# EAGLE design PCB (EAGLE 7.6.0)
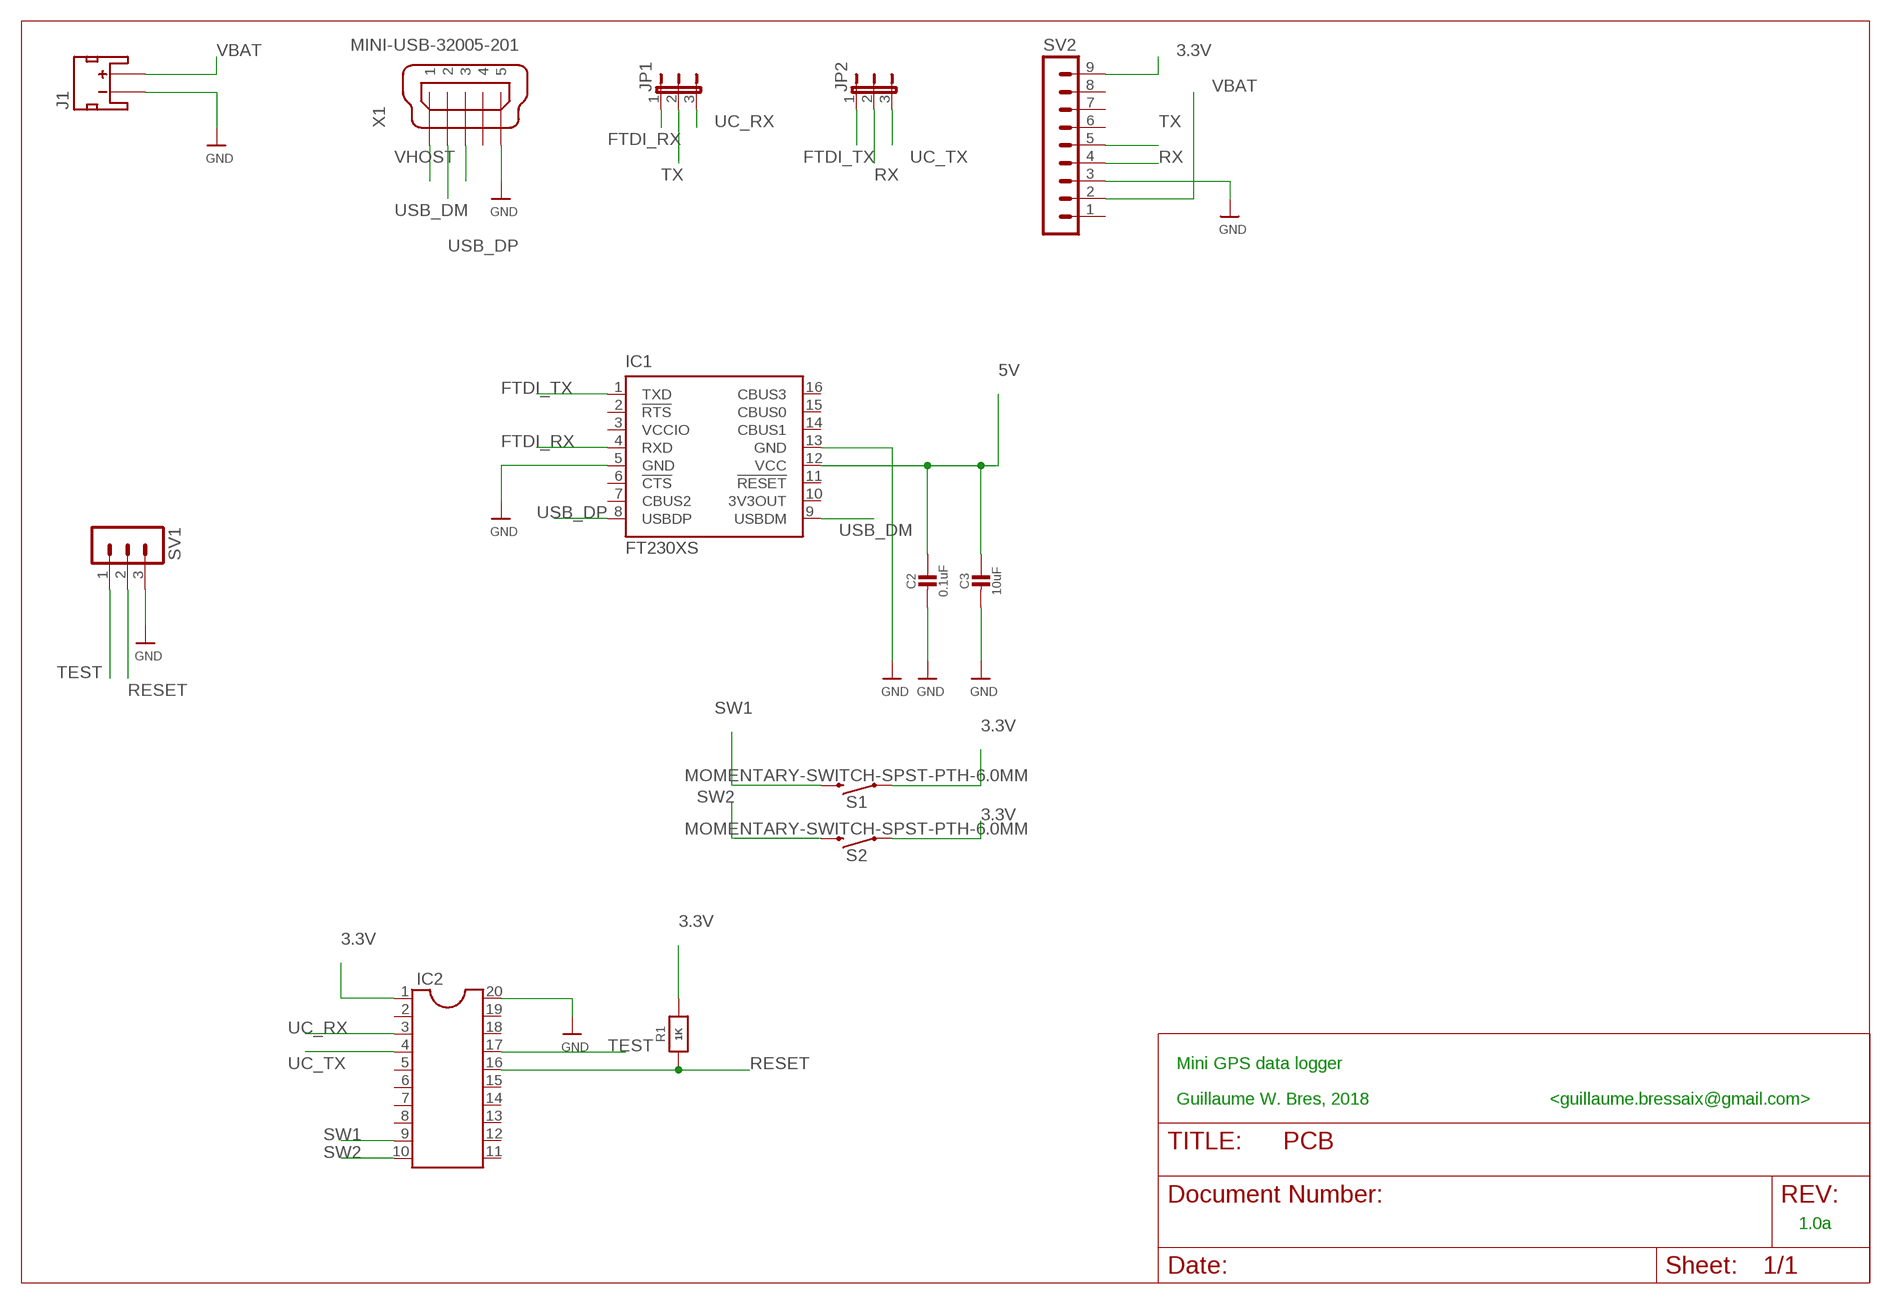
[diagram p0: schematic, sheet 1]

## Parts
C2  0.1uF  CAP_CERAMIC0805-NOOUTLINE  [0805-NO]
C3  10uF  CAP_CERAMIC0805-NOOUTLINE  [0805-NO]
IC1  FT230XS  [SSOP16]
IC2  DIL20  [DIL20]
J1  JST_2MM_MALE  [JST-2-SMD]
JP1  JP2E  [JP2]
JP2  JP2E  [JP2]
R1  1K  RESISTOR0805_NOOUTLINE  [0805-NO]
S1  MOMENTARY-SWITCH-SPST-PTH-6.0MM  [TACTILE_SWITCH_PTH_6.0MM]
S2  MOMENTARY-SWITCH-SPST-PTH-6.0MM  [TACTILE_SWITCH_PTH_6.0MM]
SV1  MA03-1  [MA03-1]
SV2  MA09-1  [MA09-1]
X1  MINI-USB-32005-201  [32005-201]

## Nets
3.3V: IC2.1 R1.2 S1.1 S2.1 SV2.9
5V: C2.1 C3.1 IC1.12(VCC)
FTDI_RX: IC1.4(RXD) JP1.1
FTDI_TX: IC1.1(TXD) JP2.1
GND: C2.2 C3.2 IC1.5(GND) IC1.13(GND) IC2.20 J1.1(-) SV1.3 SV2.3 X1.5
RESET: IC2.16 R1.1 SV1.2
RX: JP2.2 SV2.4
SW1: IC2.9 S1.3
SW2: IC2.10 S2.3
TEST: IC2.17 SV1.1
TX: JP1.2 SV2.5
UC_RX: IC2.3 JP1.3
UC_TX: IC2.4 JP2.3
USB_DM: IC1.9(USBDM) X1.2
USB_DP: IC1.8(USBDP) X1.3
VBAT: J1.2(+) SV2.2
VHOST: X1.1
Unconnected: IC1.2(!RTS) IC1.6(!CTS) IC1.7(CBUS2) IC1.10(3V3OUT) IC1.11(!RESET) IC1.14(CBUS1) IC1.15(CBUS0) IC1.16(CBUS3) IC2.2 IC2.5 IC2.6 IC2.7 IC2.8 IC2.11 IC2.12 IC2.13 IC2.14 IC2.15 IC2.18 IC2.19 J1.NC1(PAD1) J1.NC2(PAD2) SV2.1 SV2.6 SV2.7 SV2.8 X1.4

## Notes on the sheet
- Mini GPS data logger
- Guillaume W. Bres, 2018 | <guillaume.bressaix@gmail.com>
- 1.0a

## Power pins joined to a net without a drawn wire
VCCIO: IC1.3(VCCIO)

## Library data of the parts
C2 C3 = microbuilder:CAP_CERAMIC: Ceramic Capacitors For new designs, use the packages preceded by an '_' character since they are more reliable: The following footprints should be used on most boards: _0402 - Standard footprint for regular board layouts _0603 - Standard footprint for regular board layouts _0805 - Standard footprint for regular board layouts _1206 - Standard footprint for regular board layouts For extremely tight-pitch boards where space is at a premium, the following 'micro-pitch' footprints can be used (smaller pads, no silkscreen outline, etc.): _0402MP - Micro-pitch footprint for very dense/compact boards _0603MP - Micro-pitch footprint for very dense/compact boards _0805MP - Micro-pitch footprint for very dense/compact boards _1206MP - Micro-pitch footprint for very dense/compact boards
IC1 = ftdichip:FT230X: USB to BASIC UART IC Auto generated by make-symbol-device-package-bsdl.ulp Rev. 43 Source: Data sheet <http://www.ftdichip.com/Support/Documents/DataSheets/ICs/DS_FT230X.pdf>
IC2 = ic-package:DIL20: Dual In Line / Socket
J1 = SparkFun-Connectors:JST_2MM_MALE: JST 2MM MALE RA CONNECTOR Two pin, compact surface mount connector. Commonly used as a battery input connection point. We really like the solid locking feeling and high current rating on these small connectors. We use these all the time as battery connectors. Mates to single-cell LiPo batteries. Here is the connector we sell at SparkFun: JST Right Angle Connector - White <https://www.sparkfun.com/products/8612> (PRT-08612) Datasheet <http://www.sparkfun.com/datasheets/Prototyping/Connectors/JST-Horizontal.pdf> It was used on these SparkFun products: SparkFun MOSFET Power Controller <https://www.sparkfun.com/products/11214> (PRT-11214) SparkFun Battery Babysitter - LiPo Battery Manager <https://www.sparkfun.com/products/13777> (PRT-13777) And many, many others that required a lipo battery connection.; PROD_ID: CONN-11443; SF_ID: PRT-08612
JP1 JP2 = jumper:JP2E: JUMPER
R1 = microbuilder:RESISTOR: Resistors For new designs, use the packages preceded by an '_' character since they are more reliable: The following footprints should be used on most boards: _0402 - Standard footprint for regular board layouts _0603 - Standard footprint for regular board layouts _0805 - Standard footprint for regular board layouts _1206 - Standard footprint for regular board layouts For extremely tight-pitch boards where space is at a premium, the following 'micro-pitch' footprints can be used (smaller pads, no silkscreen outline, etc.): _0402MP - Micro-pitch footprint for very dense/compact boards _0603MP - Micro-pitch footprint for very dense/compact boards _0805MP - Micro-pitch footprint for very dense/compact boards _1206MP - Micro-pitch footprint for very dense/compact boards
S1 S2 = SparkFun-Switches:MOMENTARY-SWITCH-SPST: Momentary Switch (Pushbutton) - SPST Normally-open (NO) SPST momentary switches (buttons, pushbuttons). Variants PTH-12MM - 12mm square, through-hole Momentary Pushbutton Switch - 12mm Square <https://www.sparkfun.com/products/9190> (COM-09190) PTH-6.0MM, PTH-6.0MM-KIT - 6.0mm square, through-hole Mini Pushbutton Switch <https://www.sparkfun.com/products/97> (COM-00097) KIT package intended for soldering kit's - only one side of pads' copper is exposed. PTH-RIGHT-ANGLE-KIT - Right-angle, through-hole Right Angle Tactile Button <https://www.sparkfun.com/products/10791> - Used on SparkFun BigTime Watch Kit <https://www.sparkfun.com/products/11734> SMD-12MM - 12mm square, surface-mount Tactile Button - SMD (12mm) <https://www.sparkfun.com/products/12993> (COM-12993) Used on SparkFun PicoBoard <https://www.sparkfun.com/products/11888> SMD-4.5MM - 4.5mm Square Trackball Switch Used on SparkFun Blackberry Trackballer Breakout <https://www.sparkfun.com/products/13169> SMD-4.6MMX2.8MM - 4.60mm x 2.80mm, surface mount Used on SparkFun SAMD21 Mini Breakout <https://www.sparkfun.com/products/13664> SMD-5.2MM, SMD-5.2-REDUNDANT - 5.2mm square, surface-mount Mini Pushbutton Switch - SMD <https://www.sparkfun.com/products/8720> (COM-08720) Used on Arduino Pro Mini <https://www.sparkfun.com/products/11114> REDUNDANT package connects both switch circuits together SMD-6.0X3.5MM - 6.0 x 3.5mm, surface mount Momentary Reset Switch SMD <https://www.sparkfun.com/products/8229> (COM-08229) SMD-6.2MM-TALL - 6.2mm square, surface mount Tactile Button - SMD (6mm) <https://www.sparkfun.com/products/12992> Used on SparkFun Digital Sandbox <https://www.sparkfun.com/products/12651> SMD-RIGHT-ANGLE - Right-angle, surface mount Used on SparkFun Block for Intel® Edison - Arduino <https://www.sparkfun.com/products/13036>; PROD_ID: SWCH-08441; SF_SKU: COM-00097
SV1 = con-lstb:MA03-1: PIN HEADER; OC_FARNELL: unknown; OC_NEWARK: unknown
SV2 = con-lstb:MA09-1: PIN HEADER; OC_FARNELL: unknown; OC_NEWARK: unknown
X1 = con-cypressindustries:MINI-USB-: MINI USB-B Conector Source: www.cypressindustries.com; OC_FARNELL: unknown; OC_NEWARK: unknown

## Board
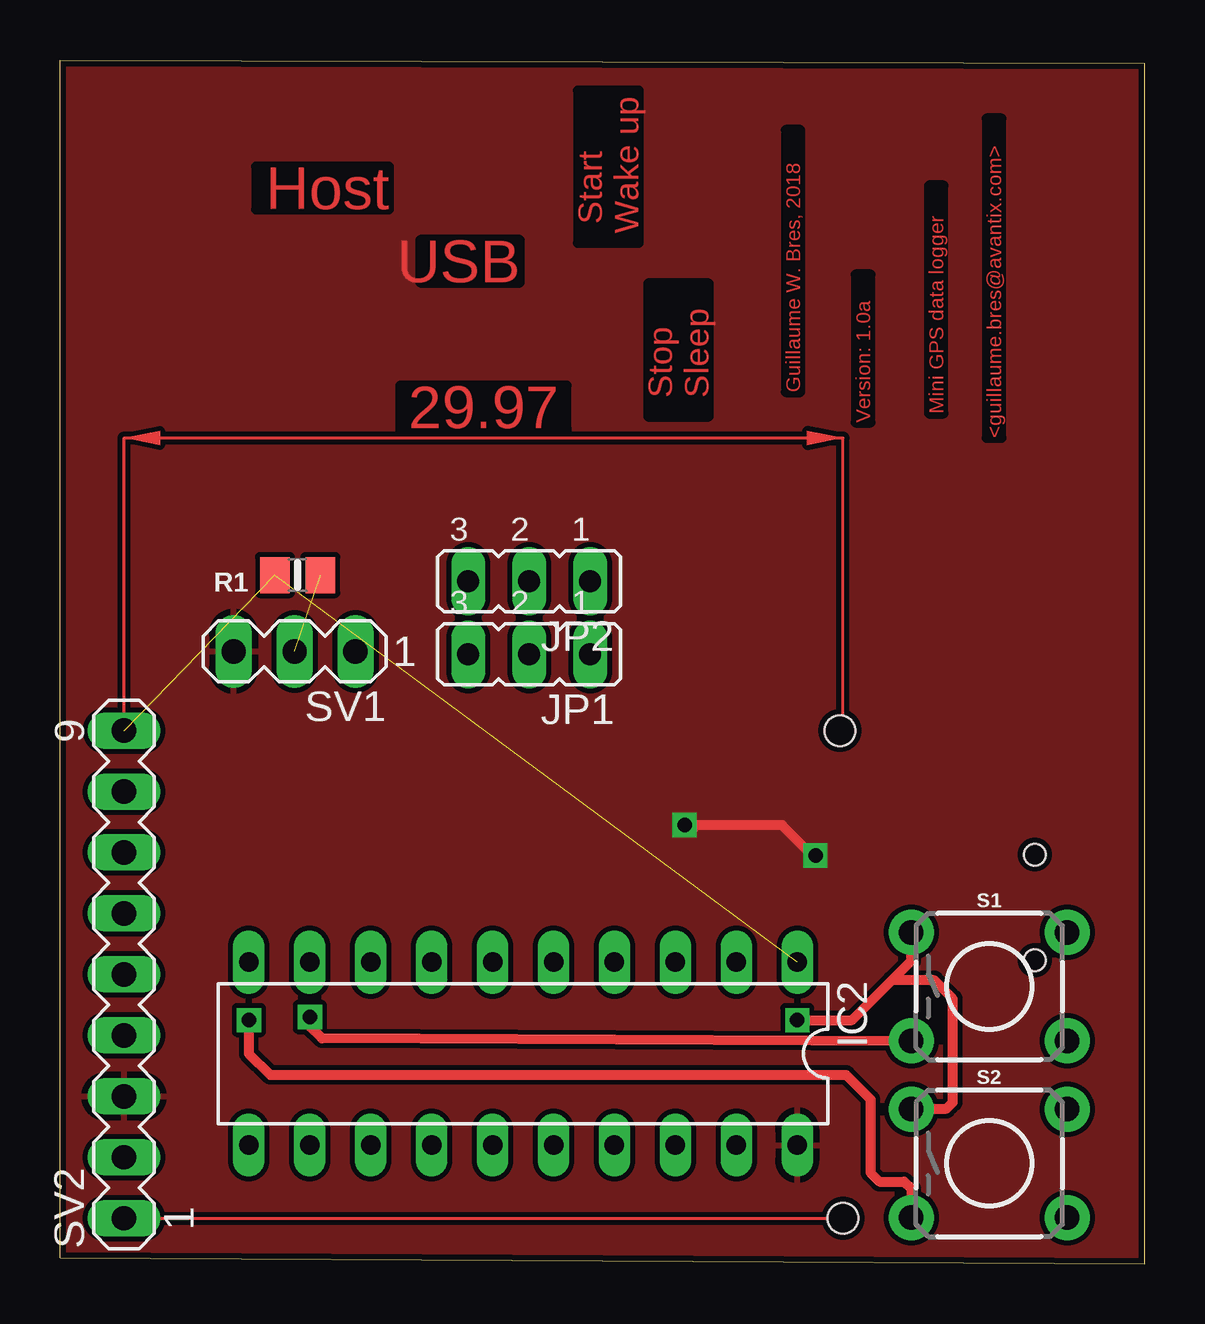
[diagram p1: board, top side]
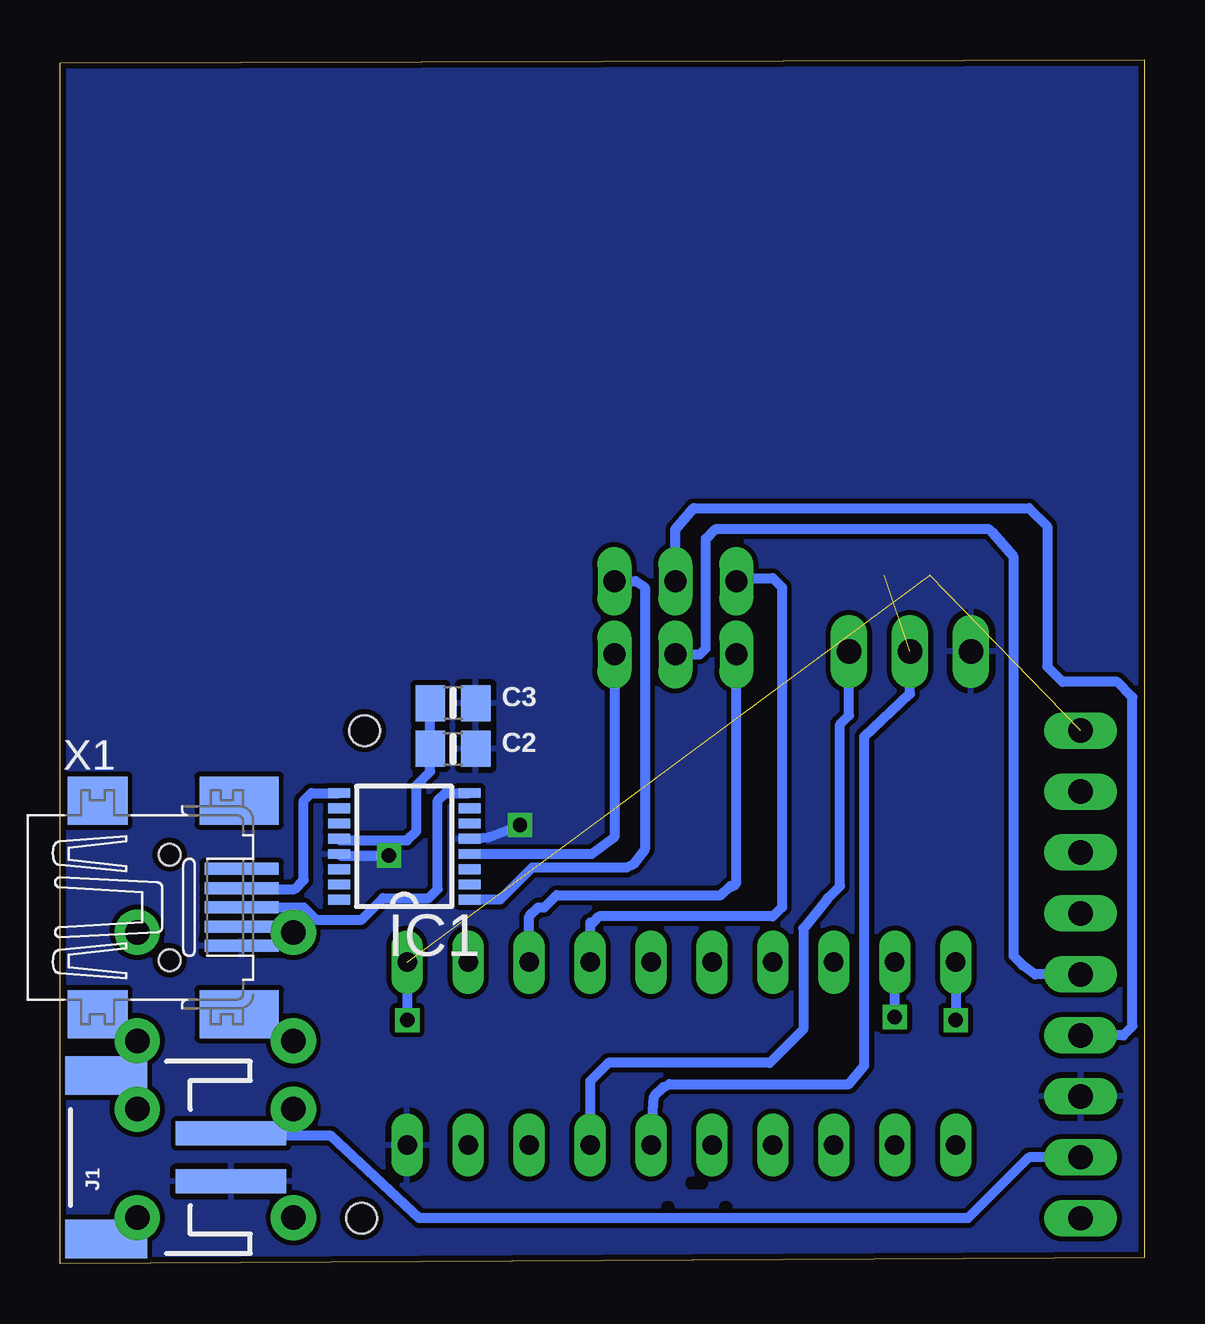
[diagram p2: board, bottom side, seen from below]

Size 45.21 x 50.16 mm. Coordinates in mm from the lower left corner, seen from the top.
Outline: 0,50.16 45.21,50.04 45.21,0 0,0.25 0,50.16
Copper layers (1*16): Top 0.035mm / dielectric 1.5mm / Bottom 0.035mm
Design rules "adafruit *": minimum track width 8mil, minimum drill 15.5mil, track to track 8mil, track to pad 8mil, pad to pad 8mil, via to via 8mil, smd to smd 8mil, copper to edge 10mil, drill to drill 8mil, minimum pad ring 10mil, minimum via ring 8mil, stop-mask expansion 2mil, vias tented up to drill 20mil, thermal gap 10mil
Holes 1.27 mm at 32.64,1.91 32.51,22.22
bRestrict: area 18.4,3.3 to 18.9,3.4; area 17.4,1.9 to 17.5,2.4; area 19.8,1.9 to 19.9,2.4

### Footprints (pad centres in the part's own frame; a part is rotated, then mirrored left to right if it is on the bottom)
0805-NO = smd 1.24 x 1.5: 1 -0.95,0; 2 0.95,0
SSOP16 = smd 0.914 x 0.406: 1 -2.718,2.223; 2 -2.718,1.587; 3 -2.718,0.953; 4 -2.718,0.318; 5 -2.718,-0.318; 6 -2.718,-0.953; 7 -2.718,-1.587; 8 -2.718,-2.223; 9 2.718,-2.223; 10 2.718,-1.587; 11 2.718,-0.953; 12 2.718,-0.318; 13 2.718,0.318; 14 2.718,0.953; 15 2.718,1.587; 16 2.718,2.223
DIL20 = drill 0.813 long: 1 -11.43,-3.81; 2 -8.89,-3.81; 3 -6.35,-3.81; 4 -3.81,-3.81; 5 -1.27,-3.81; 6 1.27,-3.81; 7 3.81,-3.81; 8 6.35,-3.81; 9 8.89,-3.81; 10 11.43,-3.81; 11 11.43,3.81; 12 8.89,3.81; 13 6.35,3.81; 14 3.81,3.81; 15 1.27,3.81; 16 -1.27,3.81; 17 -3.81,3.81; 18 -6.35,3.81; 19 -8.89,3.81; 20 -11.43,3.81
JST-2-SMD = smd 1 x 4.6: 1 -1,-3.7; 2 1,-3.7 | smd 1.6 x 3.4: NC1 -3.4,1.5; NC2 3.4,1.5
JP2 = drill 0.914 long: 1 -2.54,0; 2 0,0; 3 2.54,0
TACTILE_SWITCH_PTH_6.0MM = drill 1.016 pad 1.88: 1 -3.251,2.261; 2 3.251,2.261; 3 -3.251,-2.261; 4 3.251,-2.261
MA03-1 = drill 1.016 long: 1 -2.54,0; 2 0,0; 3 2.54,0
MA09-1 = drill 1.016 long: 1 -10.16,0; 2 -7.62,0; 3 -5.08,0; 4 -2.54,0; 5 0,0; 6 2.54,0; 7 5.08,0; 8 7.62,0; 9 10.16,0
32005-201 = smd 3.1 x 0.5: 1 3,1.6; 2 3,0.8; 3 3,0; 4 3,-0.8; 5 3,-1.6 | smd 2.5 x 2: M1 -3,-4.45; M2 -3,4.45 | smd 3.3 x 2: M3 2.9,4.45; M4 2.9,-4.45 | hole 0.9: 0,2.2; 0,-2.2

### Placement (x,y rotation side)
C2  28.83,21.46 0 bottom
C3  28.83,23.37 0 bottom
IC1  30.86,17.4 180 bottom
IC2  19.3,8.76 180 top
J1  41.78,4.44 90 bottom
JP1  19.56,25.4 180 top
JP2  19.56,28.45 180 top
R1  9.91,28.7 180 top
S1  38.73,11.56 0 top
S2  38.73,4.19 0 top
SV1  9.78,25.53 180 top
SV2  2.67,12.07 90 top
X1  40.64,14.86 0 bottom

### Tracks (layer width: path | path; a pad name or v marks a point on that pad's centre or on a via)
3.3V  (via drill 0.6)  (2 unrouted)
  Top 0.406: v30.73,10.16 33.02,10.16 34.67,11.81 | 34.67,11.81 35.48,12.62 S1.1 | S2.1 35.46,6.48 36.96,6.48 37.21,6.73 37.21,11.05 36.45,11.81 34.67,11.81
  Bottom 0.406: IC2.1 v30.73,10.16
5V
  Bottom 0.406: C3.1 C2.1 29.78,20.51 30.35,19.94 30.35,18.03 30.73,17.65 33.52,17.65 IC1.12
FTDI_RX
  Bottom 0.406: JP1.1 22.1,17.78 23.05,17.08 IC1.4
FTDI_TX
  Bottom 0.406: JP2.1 21.21,28.45 20.83,28.19 20.83,17.27 21.34,16.64 21.59,16.51 25.53,16.51 26.86,15.18 IC1.1
GND  (via drill 0.6)
  Top 0.406: 26.42,18.16 26.16,18.16 v26.04,18.29 30.1,18.29 31.5,16.89 v31.5,17.02
  Bottom 0.406: IC1.5 27.32,17.78 v26.04,18.29 | IC1.13 33.52,17.02 v31.5,17.02
  pour Top (isolate 0.203): -0.38,-0.13 -0.38,50.05 45.47,50.05 45.59,-0.25
  pour Bottom (isolate 0.203): -0.38,-0.13 -0.38,50.31 45.47,50.05 45.59,-0.25
RESET  (1 unrouted)
  Bottom 0.406: IC2.16 20.57,5.21 20.45,6.98 20.07,7.37 19.81,7.49 12.32,7.49 11.68,8.26 11.68,21.97 9.78,23.75 SV1.2
RX
  Bottom 0.406: JP2.2 19.56,30.61 18.8,31.5 4.83,31.5 4.06,30.73 4.06,24.89 3.43,24.26 1.14,24.26 0.51,23.62 0.51,9.91 0.89,9.53 SV2.4
SW1  (via drill 0.6)
  Top 0.406: S1.3 35.38,9.27 10.92,9.4 10.41,9.91 v10.41,10.29
  Bottom 0.406: v10.41,10.29 IC2.9
SW2  (via drill 0.6)
  Top 0.406: v7.87,10.16 7.87,8.76 8.76,7.87 32.77,7.87 33.78,6.86 33.78,3.81 34.16,3.43 35.18,3.43 35.48,3.12 S2.3
  Bottom 0.406: IC2.10 v7.87,10.16
TEST
  Bottom 0.406: IC2.17 23.11,7.62 22.35,8.38 15.62,8.38 14.22,9.78 14.22,13.97 13.21,15.24 12.7,15.75 12.7,22.48 12.32,22.86 SV1.1
TX
  Bottom 0.406: JP1.2 18.54,25.4 18.29,25.65 18.29,30.23 17.91,30.61 6.48,30.61 6.35,30.48 5.46,29.46 5.46,12.83 5.08,12.45 4.57,12.07 SV2.5
UC_RX
  Bottom 0.406: IC2.3 25.65,14.48 25.27,14.86 25.02,14.86 24.51,15.37 17.65,15.37 17.27,15.75 17.14,15.75 17.02,15.88 JP1.3
UC_TX
  Bottom 0.406: JP2.3 16.89,28.57 15.49,28.57 15.11,28.19 15.11,14.86 15.49,14.48 22.73,14.48 22.99,14.22 23.11,14.22 IC2.4
USB_DM
  Bottom 0.406: X1.2 37.6,15.62 35.43,15.62 35.05,16 35.05,19.3 34.73,19.62 IC1.9
USB_DP
  Bottom 0.406: X1.3 35.05,14.86 34.54,14.35 32.64,14.35 31.75,15.24 29.84,15.24 29.46,15.62 29.46,19.3 29.15,19.62 IC1.8
VBAT
  Bottom 0.406: SV2.2 4.83,4.44 7.37,1.91 30.23,1.91 33.91,5.33 38.73,5.33 38.62,5.44 J1.2
(copper drawn outside any net)
  shapes: Top area x2

### Text on the board
Top: Host | USB | Start / Wake up | Guillaume W. Bres, 2018 | Stop / Sleep | Version: 1.0a | Mini GPS data logger | <guillaume.bres@avantix.com>